# Altium schematic sheet RS485.SchDoc
size A3
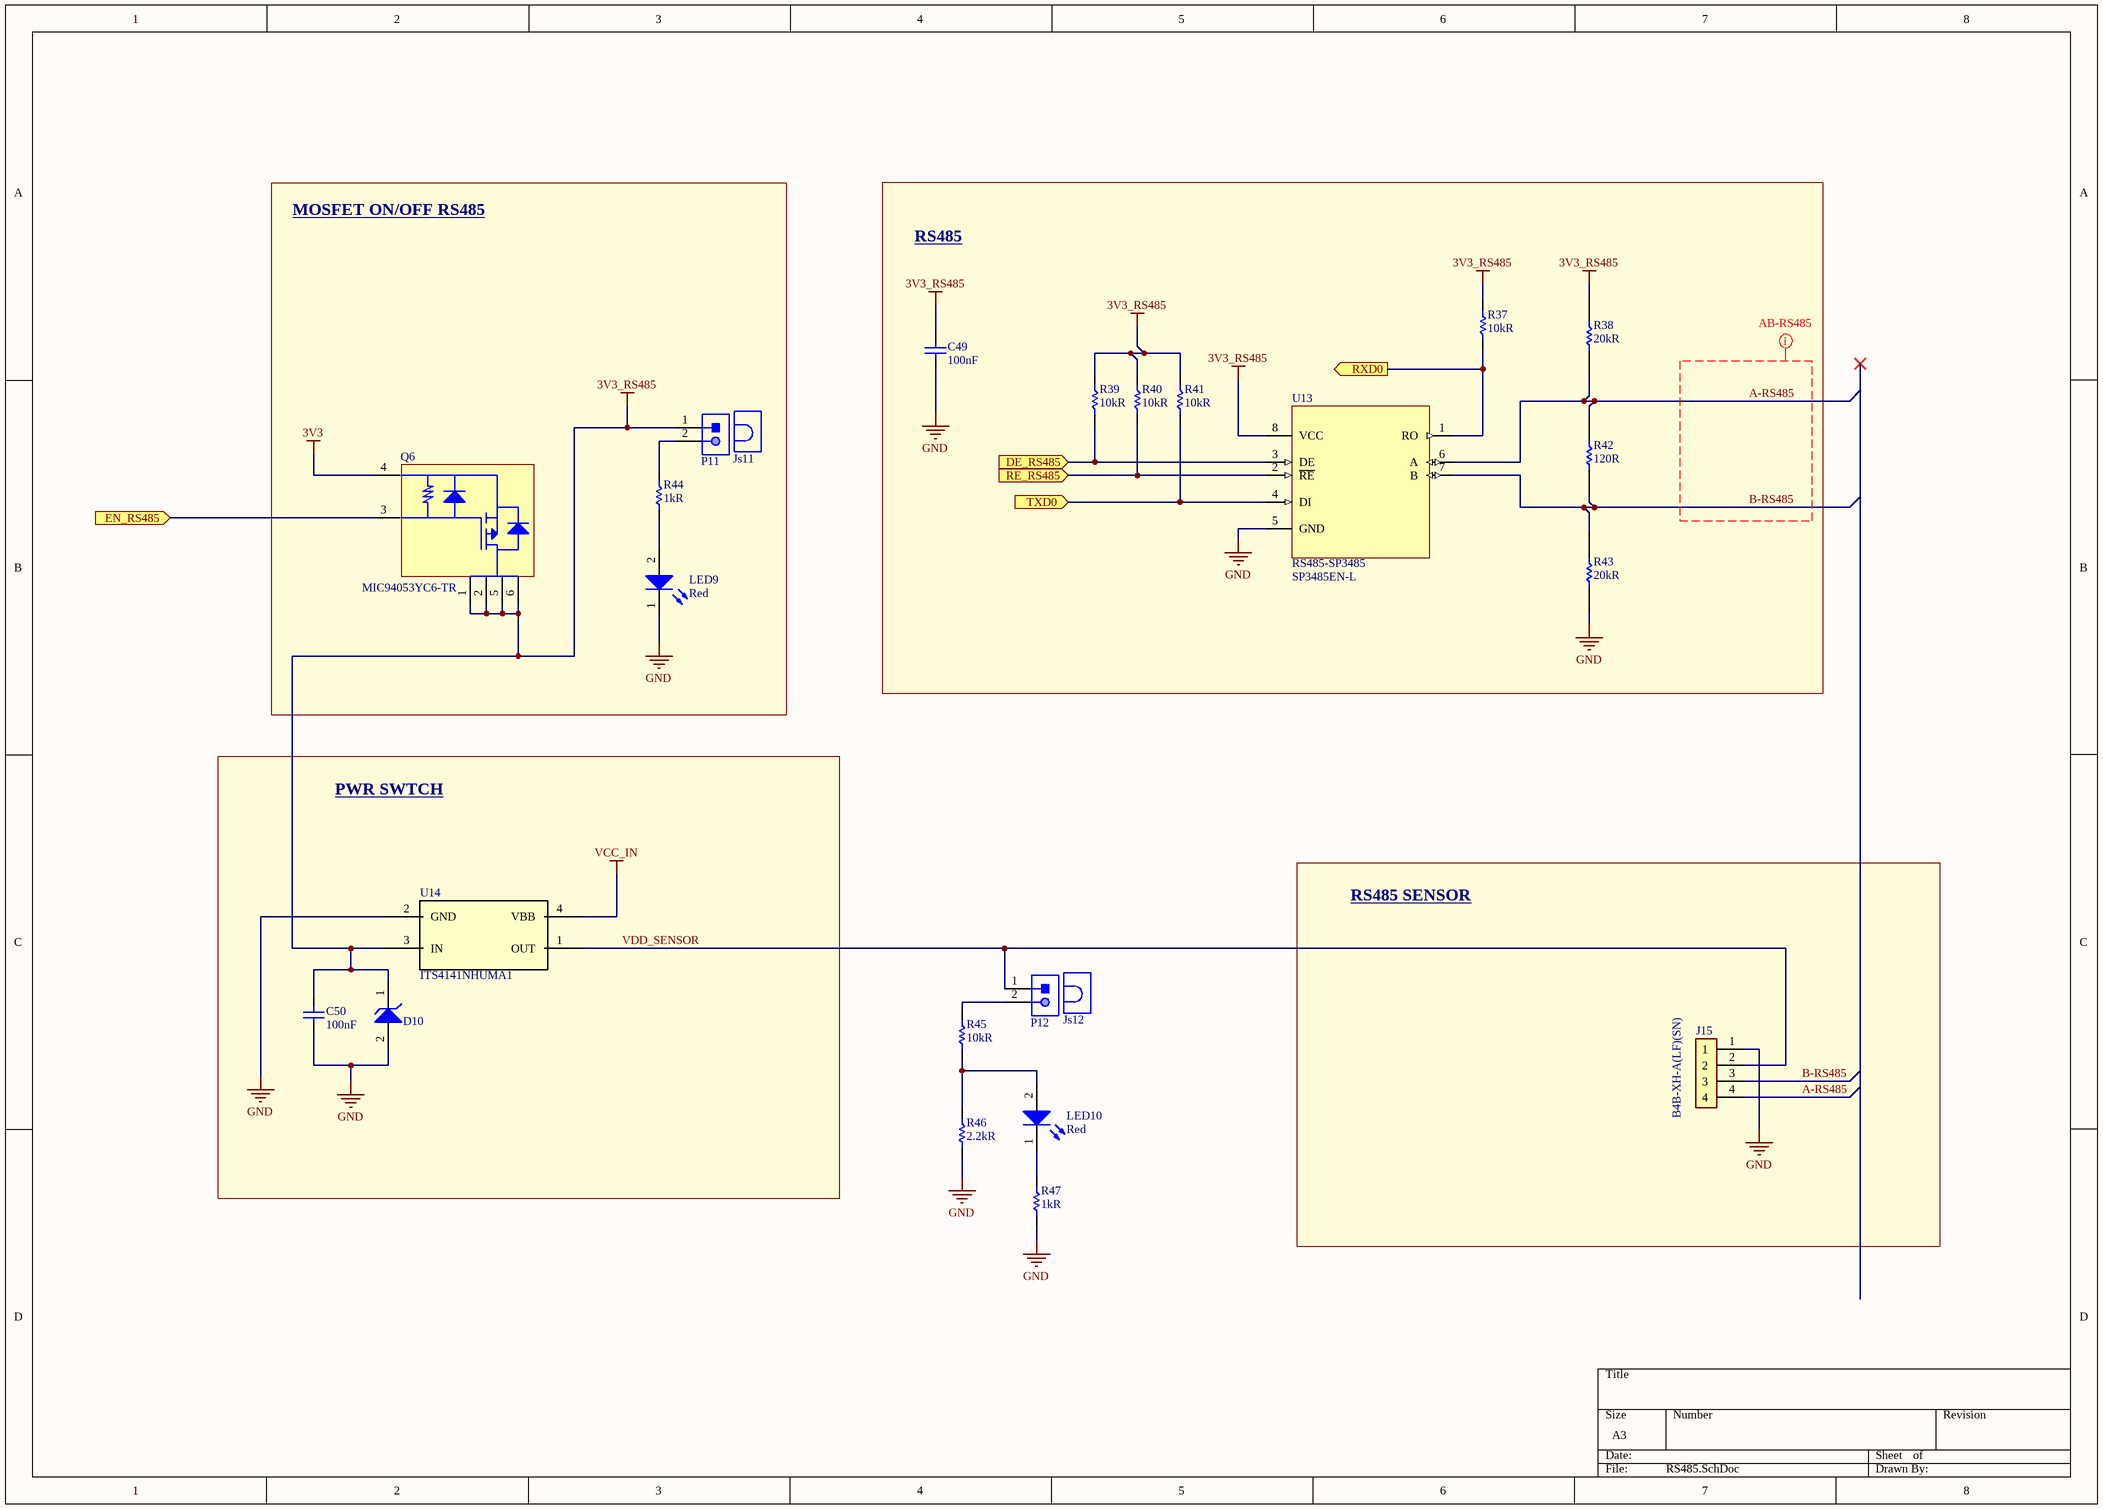
[diagram p0: RS485.SchDoc]

## Parts
C49  100nF  [Cap 0805 (2012 Metric)]
C50  100nF  [Cap 0805 (2012 Metric)]
D10  Diode  [Diode SOD123]  (value not drawn)
J15  B4B-XH-A(LF)(SN)  [B4B-XH-A(LF)(SN)]
Js11  Jumper (2x1)  [Header JMP 2x1]  (value not drawn)
Js12  Jumper (2x1)  [Header JMP 2x1]  (value not drawn)
LED9  Red  [LED 0805(2012 METRIC)]
LED10  Red  [LED 0805(2012 METRIC)]
P11  Header 2x1  [Header 2x1]  (value not drawn)
P12  Header 2x1  [Header 2x1]  (value not drawn)
Q6  MIC94053YC6-TR  [SC-70-6]
R37  10kR  [Res 0603 (1608 Metric)]
R38  20kR  [Res 0805 (2012 Metric)]
R39  10kR  [Res 0603 (1608 Metric)]
R40  10kR  [Res 0603 (1608 Metric)]
R41  10kR  [Res 0603 (1608 Metric)]
R42  120R  [Res 0805 (2012 Metric)]
R43  20kR  [Res 0805 (2012 Metric)]
R44  1kR  [Res 0805 (2012 Metric)]
R45  10kR  [Res 0603 (1608 Metric)]
R46  2.2kR  [Res 0805 (2012 Metric)]
R47  1kR  [Res 0805 (2012 Metric)]
U13  RS485-SP3485  Manufacturer Part Number: SP3485EN-L  [SP3485]
U14  ITS4141NHUMA1  [ITS4141NHUMA1]

## Blocks framed on the sheet
MOSFET ON/OFF RS485: Js11 LED9 P11 Q6 R44
RS485: C49 R37-R43 U13
PWR SWTCH: C50 D10 U14
RS485 SENSOR: J15

## Ports
DE_RS485 (in), EN_RS485 (in), RE_RS485 (in), RXD0 (out), TXD0 (in)

## Nets
3V3: Q6.4(S)
3V3_RS485: C49.1 C50.1 D10.1(K) P11.1 Q6.1(D) Q6.2(D) Q6.5(D) Q6.6(D) R37.1 R38.1 R39.1 R40.1 R41.1 U13.8(VCC) U14.3(IN)
GND: C49.2 C50.2 D10.2(A) J15.1 LED9.1(K) R43.2 R46.2 R47.2 U13.5(GND) U14.2(GND)
VCC_IN: U14.4(VBB)
A-RS485: J15.4 R38.2 R42.1 U13.6(A)
B-RS485: J15.3 R42.2 R43.1 U13.7(B)
DE_RS485: R39.2 U13.3(DE) ; port DE_RS485
EN_RS485: Q6.3(G) ; port EN_RS485
RE_RS485: R40.2 U13.2(~{RE}) ; port RE_RS485
RXD0: R37.2 U13.1(RO) ; port RXD0
TXD0: R41.2 U13.4(DI) ; port TXD0
VDD_SENSOR: J15.2 P12.1 U14.1(OUT)
NetLED9_2: LED9.2(A) R44.2
NetLED10_1: LED10.1(K) R47.1
NetLED10_2: LED10.2(A) R45.2 R46.1
NetP11_2: P11.2 R44.1
NetP12_2: P12.2 R45.1

## Layout directives
net class AB-RS485: A-RS485, B-RS485

## Library data of the parts
C49 C50 = Capacitor: YAGEO (PHYCOMP)         CC0805ZRY5V9BB104             SMD Multilayer Ceramic Capacitor, 0805 [2012 Metric], 0.1 uF, 50 V, +80%, -20%, Y5V, CC Series; Tolerance: 80%; Voltage Rating: 50V; Link: https://www.digikey.com/es/products/detail/yageo/CC0805ZRY5V9BB104/2103099?s=N4IgTCBcDaIMJwAwA5EFYBaAlAmmgagJwBCxAjIgCwgC6AvkA; Supplier 1: Digi-Key; Supplier Part Number 1: 311-1361-1-ND; Manufacturer: Yageo; Manufacturer Part Number: CC0805ZRY5V9BB104; RoHS: Yes; Category: Ceramic Capacitors; Stock 1: 92689; Pricing 1: 1=0,10000, 10=0,07000, 50=0,03800, 100=0,03100, 500=0,02214, 1000=0,01739 (USD); Mount: Surface Mount; Case/Package: 0805; Number of Pins: 2; Case Code (Metric): 2012; Case Code (Imperial): 0805; Material: Ceramic; Dielectric Material: Ceramic; Min Operating Temperature: -30°C; Max Operating Temperature: 85°C; Capacitance: 100nF; Dielectric: Y5V; Package Quantity: 1; Packaging: Tape and Reel; Voltage Rating (DC): 50V; Termination: SMD/SMT; Resistor Type: Ceramic; Series: CC; Construction: Flat; Length: 2mm; Width: 0.049inch; Height: 0.6mm; Depth: 1.25mm; Thickness: 0.024inch; Radiation Hardening: No; REACH SVHC: No SVHC; Lead Free: Lead Free; Halogen Free: Halogen Free; RoHS Compliant: Yes; ComponentLink1URL: https://datasheet.ciiva.com/144/mlccorderingcode-144209.pdf?src-supplier=Digi-Key; ComponentLink1Description: https://datasheet.ciiva.com/144/mlccorderingcode-144209.pdf?src-supplier=Digi-Key; ComponentLink2URL: https://datasheet.ciiva.com/144/mlccorderingcode-144210.pdf?src-supplier=Digi-Key; ComponentLink2Description: https://datasheet.ciiva.com/144/mlccorderingcode-144210.pdf?src-supplier=Digi-Key; ComponentLink3URL: https://datasheet.ciiva.com/144/mlccorderingcode-144211.pdf?src-supplier=Digi-Key; ComponentLink3Description: https://datasheet.ciiva.com/144/mlccorderingcode-144211.pdf?src-supplier=Digi-Key; ComponentLink4URL: https://datasheet.ciiva.com/11465/upy-gphc-y5v-6-3v-to-50v-5-11465865.pdf?src-supplier=Avnet; ComponentLink4Description: https://datasheet.ciiva.com/11465/upy-gphc-y5v-6-3v-to-50v-5-11465865.pdf?src-supplier=Avnet; ComponentLink5URL: https://datasheet.ciiva.com/13389/upy-gp-np0-16v-to-50v-8-13389351.pdf?src-supplier=Mouser; ComponentLink5Description: https://datasheet.ciiva.com/13389/upy-gp-np0-16v-to-50v-8-13389351.pdf?src-supplier=Mouser; ComponentLink6URL: https://datasheet.ciiva.com/17435/upy-gphc-y5v-6-3v-to-50v-5-17435053.pdf?src-supplier=Avnet+Europe; ComponentLink6Description: https://datasheet.ciiva.com/17435/upy-gphc-y5v-6-3v-to-50v-5-17435053.pdf?src-supplier=Avnet+Europe; ComponentLink7URL: https://datasheet.ciiva.com/15189/getdatasheetpartid-55882-15189238.pdf?src-supplier=Verical; ComponentLink7Description: https://datasheet.ciiva.com/15189/getdatasheetpartid-55882-15189238.pdf?src-supplier=Verical; ComponentLink8URL: https://datasheet.ciiva.com/16747/upy-gphc-y5v-6-3v-to-50v-5-revised-16747323.pdf?src-supplier=Future+Electronics; ComponentLink8Description: https://datasheet.ciiva.com/16747/upy-gphc-y5v-6-3v-to-50v-5-revised-16747323.pdf?src-supplier=Future+Electronics; ComponentLink9URL: https://datasheet.ciiva.com/28450/1132289-28450870.pdf?src-supplier=Element14; ComponentLink9Description: https://datasheet.ciiva.com/28450/1132289-28450870.pdf?src-supplier=Element14; ComponentLink10URL: https://datasheet.ciiva.com/29241/445331-da-01-en-kerko-chip-0805-y5v0-1uf-20-80proz50vg-29241946.pdf?src-supplier=Conrad; ComponentLink10Description: https://datasheet.ciiva.com/29241/445331-da-01-en-kerko-chip-0805-y5v0-1uf-20-80proz50vg-29241946.pdf?src-supplier=Conrad
D10 = Diode: DIODE GEN PURP 75V 150MA 0603; Manufacturer: Taiwan Semiconductor; Manufacturer Part Number: TS4148CRZG; Forward Voltage: 1.25V; Peak Non-Repetitive Surge Current: 800mA; Element Configuration: Single; Max Forward Surge Current (Ifsm): 2A; Reverse Recovery Time: 4ns; Link: https://www.digikey.com/es/products/detail/taiwan-semiconductor-corporation/TS4148C-RZG/7359811?s=N4IgTCBcDaICoGUAsBGJAOAwgJQFoHEQBdAXyA; Supplier 1: Digi-Key; Supplier Part Number 1: TS4148CRZGCT-ND; RoHS: Yes; Category: Uncategorized; Stock 1: 278970; Pricing 1: 1=0,39000, 10=0,29400, 100=0,16640, 500=0,11022, 1000=0,08450, 2000=0,07348 (USD); Mount: Surface Mount; Case/Package: SMD/SMT; Number of Pins: 2; Min Operating Temperature: -55°C; Max Operating Temperature: 150°C; Packaging: Tape and Reel; Package Quantity: 5000; Max Repetitive Reverse Voltage (Vrrm): 75V; Radiation Hardening: No; RoHS Compliant: Yes; ComponentLink1URL: https://datasheet.ciiva.com/18168/getdatasheetpartid-464901-18168310.pdf?src-supplier=Verical; ComponentLink1Description: https://datasheet.ciiva.com/18168/getdatasheetpartid-464901-18168310.pdf?src-supplier=Verical
J15 = B4B-XH-A(LF)(SN): JST (JAPAN SOLDERLESS TERMINALS) - B4B-XH-A (LF)(SN) - Wire-To-Board Connector, Vertical, 2.5 mm, 4 Contacts, Header, XH Series, Through Hole, 1 Rows; Insulation Resistance: 1GR; Current Rating: 3A; Contact Resistance: 20mR; Gender: Male; Number of Positions: 4; Max Voltage Rating (AC): 250V; Connector Type: Male Pin; Pitch: 2.5mm; Wire/Cable Gauge: 22AWG; Supplier 1: Arrow Electronics; Manufacturer: JST; RoHS: Yes; Category: FFC / FPC; Mount: Through Hole; Contact Plating: Tin,Copper,Lead; Contact Material: Brass; Color: Natural; Housing Material: Polyamide; Housing Color: White; Material: Polyamide; Min Operating Temperature: -25°C; Max Operating Temperature: 85°C; Termination: Press-Fit; Series: XH; Number of Rows: 1; Packaging: Bulk; Orientation: Straight; Max Current Rating: 3A; Package Quantity: 500; Number of Contacts: 4; Contact Type: Male Pin; Voltage Rating (AC): 250V; Voltage Rating: 250V; Max Voltage Rating (DC): 250V; Length: 12.4mm; Depth: 5.75mm; Lead Pitch: 2.5mm; REACH SVHC: No SVHC; Lead Free: Lead Free; ComponentLink1URL: https://datasheet.ciiva.com/26894/getdatasheetpartid-455616-26894787.pdf?src-supplier=Verical; ComponentLink1Description: https://datasheet.ciiva.com/26894/getdatasheetpartid-455616-26894787.pdf?src-supplier=Verical; ComponentLink2URL: https://datasheet.ciiva.com/16203/b4b-xh-alfsn-16203642.pdf?src-supplier=Future+Electronics; ComponentLink2Description: https://datasheet.ciiva.com/16203/b4b-xh-alfsn-16203642.pdf?src-supplier=Future+Electronics; ComponentLink3URL: https://datasheet.ciiva.com/26924/getdatasheetpartid-640571-26924035.pdf?src-supplier=Verical; ComponentLink3Description: https://datasheet.ciiva.com/26924/getdatasheetpartid-640571-26924035.pdf?src-supplier=Verical; ComponentLink4URL: https://datasheet.ciiva.com/726/exh-726404.pdf?src-supplier=Digi-Key; ComponentLink4Description: https://datasheet.ciiva.com/726/exh-726404.pdf?src-supplier=Digi-Key; Manufacturer Part Number: B4B-XH-A(LF)(SN); Supplier Part Number 1: B4B-XH-A (LF)(SN); Link: https://www.digikey.com/es/products/detail/jst-sales-america-inc/B4B-XH-A-LF-SN/1651047?s=N4IgTCBcDaIEIBY4FoAaAJZBBAFAGQDEBKHAZQDkiQBdAXyA
Js11 Js12 = Jumper (2x1): 2 (1 x 2) Position Shunt Connector Black Open Top 0.100" (2.54mm) Gold; Manufacturer: Sullins; Manufacturer Part Number: QPC02SXGN-RC; Number of Positions: 2; Pitch: 0.1inch; Link: https://www.digikey.com/product-detail/en/sullins-connector-solutions/QPC02SXGN-RC/S9337-ND/2618262; Supplier 1: Digi-Key; Supplier Part Number 1: S9337-ND; RoHS: Yes; Category: Connectors; Stock 1: 529611; Pricing 1: 1=0,10000, 10=0,05900, 25=0,04400, 50=0,03780, 100=0,03650, 250=0,03152, 500=0,03024, 1000=0,02646, 2500=0,02394 (USD); Case/Package: 100; Contact Plating: Gold; Package Quantity: 2000; Packaging: Bulk; Height: 0.235inch; Lead Free: Lead Free; ComponentLink1URL: https://datasheet.ciiva.com/767/284-sxgn-11510-767869.pdf?src-supplier=Digi-Key; ComponentLink1Description: https://datasheet.ciiva.com/767/284-sxgn-11510-767869.pdf?src-supplier=Digi-Key
LED9 LED10 = LED: SMD LED red 2.4 V 0805, 150080RS75000, Würth Elektronik; Manufacturer: Wurth Electronics; Luminous Intensity: 150mcd; Viewing Angle: 140°; Forward Voltage: 2V; Wavelength: 625nm; Lens Style: Clear,Rectangular; Forward Current: 30mA; Test Current: 20mA; Link: https://www.digikey.com/es/products/detail/w%C3%BCrth-elektronik/150080RS75000/4489918?s=N4IgTCBcDaIIwFYAMSAcSBKBlA7MlIAugL5A; Supplier 1: Digi-Key; Supplier Part Number 1: 732-4984-1-ND; Manufacturer Part Number: 150080RS75000; RoHS: Yes; Category: LEDs; Stock 1: 57843; Pricing 1: 1=0,18000, 50=0,16500, 100=0,14200, 500=0,12300 (USD); Mount: Surface Mount; Case/Package: 0805; Color: Red; Case Code (Metric): 2012; Case Code (Imperial): 0805; Min Operating Temperature: -40°C; Max Operating Temperature: 85°C; Package Quantity: 4000; Packaging: Tape and Reel; Dominant Wavelength: 625nm; Length: 2mm; Width: 1.25mm; Height: 0.7mm; REACH SVHC: Unknown; RoHS Compliant: Yes; ComponentLink1URL: https://datasheet.ciiva.com/22656/150080rs75000-22656961.pdf?src-supplier=Element14; ComponentLink1Description: https://datasheet.ciiva.com/22656/150080rs75000-22656961.pdf?src-supplier=Element14; ComponentLink2URL: https://datasheet.ciiva.com/29279/759435-da-01-en-chipled-0805-w-kl-rot-150080rs75000-29279032.pdf?src-supplier=Conrad; ComponentLink2Description: https://datasheet.ciiva.com/29279/759435-da-01-en-chipled-0805-w-kl-rot-150080rs75000-29279032.pdf?src-supplier=Conrad
P11 P12 = Header 2x1: Connector Header Through Hole 2 position 0.100" (2.54mm); Manufacturer: Amphenol FCI; Manufacturer Part Number: 68001-402HLF; Number of Contacts: 2; Connector Type: Male Pin; Insulation Resistance: 5GR; Max Voltage Rating (AC): 1.5kV; Gender: Male; Current Rating: 3A; Contact Post Length: 3.05mm; Link: https://www.digikey.com/product-detail/en/amphenol-icc-fci/68001-402HLF/609-3507-ND/1530472; Supplier 1: Digi-Key; Supplier Part Number 1: 609-3507-ND; RoHS: Yes; Category: Headers and Wire Housings; Stock 1: 5598; Pricing 1: 1=0,12000, 10=0,11600, 100=0,07160, 500=0,05928, 1000=0,05187, 5000=0,04446, 10000=0,04323 (USD); Mount: Through Hole; Contact Plating: Tin; Housing Material: Thermoplastic; Housing Color: Black; Color: Black; Contact Material: Bronze; Min Operating Temperature: -65°C; Max Operating Temperature: 125°C; Termination: Solder; Number of Rows: 1; Number of Positions: 2; Orientation: Straight; Package Quantity: 100; Packaging: Bulk; Contact Gender: Male; Voltage Rating: 1.5kV; Length: 5.08mm; Pitch: 2.54mm; Contact Mating Length: 0.23inch; Depth: 2.41mm; Radiation Hardening: No; REACH SVHC: No SVHC; Flammability Rating: UL94 V-0; Lead Free: Lead Free; ComponentLink1URL: https://datasheet.ciiva.com/724/68000-724389.pdf?src-supplier=Digi-Key; ComponentLink1Description: https://datasheet.ciiva.com/724/68000-724389.pdf?src-supplier=Digi-Key; ComponentLink2URL: https://datasheet.ciiva.com/16726/68000-16726185.pdf?src-supplier=Avnet+Europe; ComponentLink2Description: https://datasheet.ciiva.com/16726/68000-16726185.pdf?src-supplier=Avnet+Europe; ComponentLink3URL: https://datasheet.ciiva.com/10149/68000-10149338.pdf?src-supplier=Avnet; ComponentLink3Description: https://datasheet.ciiva.com/10149/68000-10149338.pdf?src-supplier=Avnet; ComponentLink4URL: https://datasheet.ciiva.com/46385/1748756-46385306.pdf?src-supplier=Element14; ComponentLink4Description: https://datasheet.ciiva.com/46385/1748756-46385306.pdf?src-supplier=Element14
Q6 = TransistorMosfet(Load): P-Channel 6V 2A (Ta) 270mW (Ta) Surface Mount SC-70-6; Manufacturer: Microchip; Link: https://www.digikey.com/product-detail/en/microchip-technology/MIC94053YC6-TR/576-2939-1-ND/1822099; Supplier 1: Digi-Key; Supplier Part Number 1: 576-2939-1-ND; Manufacturer Part Number: MIC94053YC6-TR; RoHS: Yes; Category: MOSFETs; Stock 1: 3005; Pricing 1: 1=0,58000, 25=0,48000, 100=0,46250 (USD); ComponentLink1URL: https://datasheet.ciiva.com/6379/mic94052-53-6379193.pdf?src-supplier=Digi-Key; ComponentLink1Description: https://datasheet.ciiva.com/6379/mic94052-53-6379193.pdf?src-supplier=Digi-Key; ComponentLink2URL: https://datasheet.ciiva.com/6379/mic94052-53-6379189.pdf?src-supplier=Digi-Key; ComponentLink2Description: https://datasheet.ciiva.com/6379/mic94052-53-6379189.pdf?src-supplier=Digi-Key; ComponentLink3URL: https://datasheet.ciiva.com/46408/264781-46408581.pdf?src-supplier=Element14; ComponentLink3Description: https://datasheet.ciiva.com/46408/264781-46408581.pdf?src-supplier=Element14; ComponentLink4URL: https://datasheet.ciiva.com/15200/getdatasheetpartid-111629-15200795.pdf?src-supplier=Verical; ComponentLink4Description: https://datasheet.ciiva.com/15200/getdatasheetpartid-111629-15200795.pdf?src-supplier=Verical
R37 R39-R41 R45 = Resistor: PANASONIC - ERJ-3EKF1002V. - THICK FILM CHIP RES, 0603, 1%, PRECISION; Temperature Coefficient: 100ppm/°C; Power Rating: 100mW; Voltage Rating: 75V; Link: https://www.digikey.com/es/products/detail/panasonic-electronic-components/ERJ-3EKF1002V/196066?s=N4IgTCBcDaIKICUBSBaAzHA0gMQIwAZ8wA1EAXQF8g; Supplier 1: Digi-Key; Supplier Part Number 1: P10.0KHCT-ND; Manufacturer: Panasonic; Manufacturer Part Number: ERJ-3EKF1002V; RoHS: Yes; Category: Chip SMD Resistors; Stock 1: 4473924; Pricing 1: 1=0,10000, 10=0,03700, 100=0,01490, 1000=0,00670, 2500=0,00582 (USD); Mount: Surface Mount; Case/Package: 0603; Number of Pins: 2; Case Code (Metric): 1608; Case Code (Imperial): 0603; Contact Plating: Tin; Size Code: 0603; Min Operating Temperature: -55°C; Max Operating Temperature: 155°C; Resistance: 10kR; Packaging: Tape and Reel; Tolerance: 1%; Series: ERJ; Resistor Type: Thick Film; Number of Terminations: 2; Package Quantity: 1; Termination: SMD/SMT; Max Power Dissipation: 100mW; Voltage Rating (DC): 75V; Resistance Tolerance: 1%; Construction: Rectangular; Features: Automotive AEC-Q200; Technology: THICK FILM; Length: 1.6mm; Width: 0.031inch; Height: 0.45mm; Depth: 0.8mm; Radiation Hardening: No; Military Standard: Not; Lead Free: Lead Free; RoHS Compliant: Yes; REACH SVHC: No SVHC; ComponentLink1URL: https://datasheet.ciiva.com/48530/aoa0000ce2-48530988.pdf?src-supplier=Avnet; ComponentLink1Description: https://datasheet.ciiva.com/48530/aoa0000ce2-48530988.pdf?src-supplier=Avnet; ComponentLink2URL: https://datasheet.ciiva.com/24070/aoa0000ce2-24070318.pdf?src-supplier=Mouser; ComponentLink2Description: https://datasheet.ciiva.com/24070/aoa0000ce2-24070318.pdf?src-supplier=Mouser; ComponentLink3URL: https://datasheet.ciiva.com/9194/aoa0000ce2-9194199.pdf?src-supplier=Avnet; ComponentLink3Description: https://datasheet.ciiva.com/9194/aoa0000ce2-9194199.pdf?src-supplier=Avnet; ComponentLink4URL: https://datasheet.ciiva.com/30208/aoa0000ce2-30208985.pdf?src-supplier=Onlinecomponents.com; ComponentLink4Description: https://datasheet.ciiva.com/30208/aoa0000ce2-30208985.pdf?src-supplier=Onlinecomponents.com; ComponentLink5URL: https://datasheet.ciiva.com/16759/70260748-16759807.pdf?src-supplier=Allied+Electronics; ComponentLink5Description: https://datasheet.ciiva.com/16759/70260748-16759807.pdf?src-supplier=Allied+Electronics; ComponentLink6URL: https://datasheet.ciiva.com/7830/aoa0000ce2-7830729.pdf?src-supplier=Element14; ComponentLink6Description: https://datasheet.ciiva.com/7830/aoa0000ce2-7830729.pdf?src-supplier=Element14; ComponentLink7URL: https://datasheet.ciiva.com/28514/426256-28514198.pdf?src-supplier=Element14; ComponentLink7Description: https://datasheet.ciiva.com/28514/426256-28514198.pdf?src-supplier=Element14; ComponentLink8URL: https://datasheet.ciiva.com/46372/1678782-46372725.pdf?src-supplier=Element14; ComponentLink8Description: https://datasheet.ciiva.com/46372/1678782-46372725.pdf?src-supplier=Element14; ComponentLink9URL: https://datasheet.ciiva.com/16511/aoa0000ce2-16511861.pdf?src-supplier=Avnet+Asia; ComponentLink9Description: https://datasheet.ciiva.com/16511/aoa0000ce2-16511861.pdf?src-supplier=Avnet+Asia; ComponentLink10URL: https://datasheet.ciiva.com/17212/aoa0000ce2-17212105.pdf?src-supplier=Avnet+Europe; ComponentLink10Description: https://datasheet.ciiva.com/17212/aoa0000ce2-17212105.pdf?src-supplier=Avnet+Europe
R38 R43 = Resistor: 20 kOhms ±1% 0.125W, 1/8W Chip Resistor 0805 (2012 Metric) Moisture Resistant Thick Film; Manufacturer: Yageo; Manufacturer Part Number: RC0805FR-0720KL; Temperature Coefficient: 100ppm/°C; Voltage Rating (DC): 150V; Power Rating: 125mW; Link: https://www.digikey.com/product-detail/en/yageo/RC0805FR-0720KL/311-20-0KCRCT-ND/730667; Supplier 1: Digi-Key; Supplier Part Number 1: 311-20.0KCRCT-ND; RoHS: Yes; Category: Chip SMD Resistors; Stock 1: 4531669; Pricing 1: 1=0,10000, 10=0,04000, 100=0,01630, 1000=0,00731, 2500=0,00635 (USD); Case/Package: 0805; Number of Pins: 2; Case Code (Imperial): 0805; Case Code (Metric): 2012; Min Operating Temperature: -55°C; Max Operating Temperature: 155°C; Tolerance: 1%; Resistance: 20kR; Composition: Thick Film; Packaging: Tape and Reel; Termination: SMD/SMT; Military Standard: Not; Voltage Rating: 150V; Length: 2mm; Height: 0.5mm; Depth: 1.25mm; Lead Free: Lead Free; REACH SVHC: Unknown; ComponentLink1URL: https://datasheet.ciiva.com/15189/getdatasheetpartid-330251-15189927.pdf?src-supplier=Verical; ComponentLink1Description: https://datasheet.ciiva.com/15189/getdatasheetpartid-330251-15189927.pdf?src-supplier=Verical; ComponentLink2URL: https://datasheet.ciiva.com/46395/444164-46395127.pdf?src-supplier=Element14; ComponentLink2Description: https://datasheet.ciiva.com/46395/444164-46395127.pdf?src-supplier=Element14; ComponentLink3URL: https://datasheet.ciiva.com/12666/rc0805-12666938.pdf?src-supplier=Mouser; ComponentLink3Description: https://datasheet.ciiva.com/12666/rc0805-12666938.pdf?src-supplier=Mouser
R42 = Resistor: Res Thick Film 0805 120 Ohm 1% 0.125W(1/8W) ±100ppm/C Pad SMD Automotive T/R; Manufacturer: TE Connectivity; Manufacturer Part Number: CRGCQ0805F120R; Max Power Dissipation: 125mW; Temperature Coefficient: 100ppm/°C; Link: https://www.digikey.com/product-detail/en/te-connectivity-passive-product/CRGCQ0805F120R/A129738CT-ND/8577570; Supplier 1: Digi-Key; Supplier Part Number 1: A129738CT-ND; RoHS: No; Stock 1: 30434; Pricing 1: 1=0,10000, 10=0,04800, 100=0,01960, 1000=0,00882, 2500=0,00766 (USD); Case/Package: 0805; Case Code (Imperial): 0805; Case Code (Metric): 2012; Min Operating Temperature: -55°C; Max Operating Temperature: 155°C; Number of Terminations: 2; Composition: Thick Film; Features: Moisture Resistant,Automotive AEC-Q200; Packaging: Tape and Reel; Resistance: 120R; Tolerance: 1%; ComponentLink1URL: https://4donline.ihs.com/images/VipMasterIC/IC/TYEL/TYEL-S-A0004929575/TYEL-S-A0004929575-1.pdf?hkey=52A5661711E402568146F3353EA87419&src-supplier=Farnell; ComponentLink1Description: https://4donline.ihs.com/images/VipMasterIC/IC/TYEL/TYEL-S-A0004929575/TYEL-S-A0004929575-1.pdf?hkey=52A5661711E402568146F3353EA87419&src-supplier=Farnell; ComponentLink2URL: https://www.te.com/commerce/DocumentDelivery/DDEController?Action=srchrtrv&amp;DocNm=1773204-3&amp;DocType=DS&amp;DocLang=English&src-supplier=Digi-Key; ComponentLink2Description: https://www.te.com/commerce/DocumentDelivery/DDEController?Action=srchrtrv&amp;DocNm=1773204-3&amp;DocType=DS&amp;DocLang=English&src-supplier=Digi-Key; ComponentLink3URL: https://4donline.ihs.com/images/VipMasterIC/IC/TYEL/TYEL-S-A0004929575/TYEL-S-A0004929575-1.pdf?hkey=52A5661711E402568146F3353EA87419&src-supplier=Element14; ComponentLink3Description: https://4donline.ihs.com/images/VipMasterIC/IC/TYEL/TYEL-S-A0004929575/TYEL-S-A0004929575-1.pdf?hkey=52A5661711E402568146F3353EA87419&src-supplier=Element14; ComponentLink4URL: https://4donline.ihs.com/images/VipMasterIC/IC/TYEL/TYEL-S-A0004929575/TYEL-S-A0004929575-1.pdf?hkey=52A5661711E402568146F3353EA87419&src-supplier=Newark; ComponentLink4Description: https://4donline.ihs.com/images/VipMasterIC/IC/TYEL/TYEL-S-A0004929575/TYEL-S-A0004929575-1.pdf?hkey=52A5661711E402568146F3353EA87419&src-supplier=Newark
R44 R47 = Resistor: RES 1K OHM 1% 1/4W 0805; Manufacturer: Stackpole Electronics; Manufacturer Part Number: RNCP0805FTD1K00; Power Rating: 250mW; Temperature Coefficient: 100ppm/°C; Link: https://www.digikey.com/es/products/detail/stackpole-electronics-inc/RNCP0805FTD1K00/2240229?s=N4IgTCBcDaIEoDkDCAFADADjQVgGIBUARARgGk00QBdAXyA; Supplier 1: Digi-Key; Supplier Part Number 1: RNCP0805FTD1K00CT-ND; RoHS: Yes; Category: Chip SMD Resistors; Stock 1: 316834; Pricing 1: 1=0,10000, 10=0,07000, 100=0,02830, 1000=0,01272, 2500=0,01104 (USD); Mount: Surface Mount; Case/Package: 0805; Case Code (Metric): 2012; Case Code (Imperial): 0805; Size Code: 0805; Min Operating Temperature: -55°C; Max Operating Temperature: 155°C; Tolerance: 1%; Resistance: 1kR; Packaging: Tape and Reel; Resistor Type: Thin Film; Number of Terminations: 2; Max Power Dissipation: 250mW; Features: Moisture Resistant,Anti-Sulfur; Series: RNCP; Length: 0.079inch; Width: 0.049inch; Height: 0.024inch; Lead Free: Lead Free; RoHS Compliant: Yes; ComponentLink1URL: https://www.seielect.com/catalog/SEI-Packaging.pdf?src-supplier=Digi-Key; ComponentLink1Description: https://www.seielect.com/catalog/SEI-Packaging.pdf?src-supplier=Digi-Key; ComponentLink2URL: https://www.seielect.com/Catalog/SEI-rncp.pdf?src-supplier=Digi-Key; ComponentLink2Description: https://www.seielect.com/Catalog/SEI-rncp.pdf?src-supplier=Digi-Key; ComponentLink3URL: http://www.seielect.com/Catalog/SEI-rncp.pdf?src-supplier=Future+Electronics; ComponentLink3Description: http://www.seielect.com/Catalog/SEI-rncp.pdf?src-supplier=Future+Electronics
R46 = Resistor: Res Thick Film 0805 2.2K Ohm 5% 1/8W ±200ppm/°C Molded SMD SMD Paper T/R; Manufacturer: Vishay Dale; Manufacturer Part Number: CRCW08052K20JNEA; Power Rating: 125mW; Voltage Rating: 150V; Link: https://www.digikey.com/es/products/detail/CRCW08052K20JNEAC/541-4169-1-ND/7928852?utm_campaign=buynow&utm_medium=aggregator&curr=usd&utm_source=octopart; Supplier 1: Digi-Key; Supplier Part Number 1: 541-2.2KACT-ND; RoHS: Yes; Category: Chip SMD Resistors; Stock 1: 1572; Pricing 1: 1=0,10000, 10=0,04200, 100=0,01700, 1000=0,00762, 2500=0,00661 (USD); Case/Package: 0805; Weight: 0.000194oz; Case Code (Imperial): 0805; Case Code (Metric): 2012; Contact Plating: Tin; Min Operating Temperature: -55°C; Max Operating Temperature: 155°C; Resistance: 2.2kR; Tolerance: 5%; Packaging: Tape and Reel; Package Quantity: 5000; Termination: SMD/SMT; Resistor Type: Thick Film; Temperature Coefficient: 200ppm/°C; Voltage Rating (DC): 150V; Working Voltage: 150V; Number of Terminations: 2; Features: Automotive AEC-Q200; Series: CRCW; Max Power Dissipation: 125mW; Construction: Rectangular; Technology: THICK FILM; Resistance Tolerance: 5%; Length: 2mm; Width: 1.25mm; Height: 0.45mm; Depth: 1.25mm; Radiation Hardening: No; Lead Free: Lead Free; RoHS Compliant: Yes; REACH SVHC: Unknown; Military Standard: Not; ComponentLink1URL: https://datasheet.ciiva.com/5552/dcrcwe3-109170-5552443.pdf?src-supplier=Mouser; ComponentLink1Description: https://datasheet.ciiva.com/5552/dcrcwe3-109170-5552443.pdf?src-supplier=Mouser; ComponentLink2URL: https://datasheet.ciiva.com/16199/dcrcwe3-16199755.pdf?src-supplier=Future+Electronics; ComponentLink2Description: https://datasheet.ciiva.com/16199/dcrcwe3-16199755.pdf?src-supplier=Future+Electronics; ComponentLink3URL: https://datasheet.ciiva.com/16723/70201119-16723963.pdf?src-supplier=Allied+Electronics; ComponentLink3Description: https://datasheet.ciiva.com/16723/70201119-16723963.pdf?src-supplier=Allied+Electronics
U13 = RS485-SP3485: Single Transmitter/Receiver RS-422/RS-485 8-Pin SOIC N; Manufacturer: Exar; Data Rate: 10Mbps; Simplex/Duplex: Half Duplex; Number of Receivers: 1; Operating Supply Voltage: 3.3V; Min Supply Voltage: 3.135V; Max Supply Voltage: 3.465V; Nominal Supply Current: 2mA; Logic Function: Transceiver; Max Power Dissipation: 600mW; Output Current: 1uA; Supplier 1: Allied Electronics; RoHS: Yes; Category: Interface ICs; Mount: Surface Mount; Case/Package: SOIC N; Number of Pins: 8; Min Operating Temperature: -40°C; Max Operating Temperature: 85°C; Packaging: Rail/Tube; Package Quantity: 98; Number of Transmitters: 1; Number of Drivers: 1; Number of Transceivers: 1; Supply Current: 2mA; Number of Transmit Buffers: 1; Number of Receive Buffers: 1; Series: SP3485; Length: 4.9mm; Width: 3.9mm; Height: 1.65mm; Radiation Hardening: No; RoHS Compliant: Yes; Lead Free: Lead Free; REACH SVHC: Unknown; ComponentLink1URL: https://datasheet.ciiva.com/23593/1563967-23593299.pdf?src-supplier=Newark; ComponentLink1Description: https://datasheet.ciiva.com/23593/1563967-23593299.pdf?src-supplier=Newark; ComponentLink2URL: https://datasheet.ciiva.com/22828/0900766b81141d5c-22828332.pdf?src-supplier=RSComponents; ComponentLink2Description: https://datasheet.ciiva.com/22828/0900766b81141d5c-22828332.pdf?src-supplier=RSComponents; ComponentLink3URL: https://datasheet.ciiva.com/26829/sp3485en-l-26829691.pdf?src-supplier=IIIC; ComponentLink3Description: https://datasheet.ciiva.com/26829/sp3485en-l-26829691.pdf?src-supplier=IIIC; ComponentLink4URL: https://datasheet.ciiva.com/1495/1563967-1495198.pdf?src-supplier=Element14; ComponentLink4Description: https://datasheet.ciiva.com/1495/1563967-1495198.pdf?src-supplier=Element14; Supplier Part Number 1: 70400827; Link: https://www.digikey.com/es/products/detail/maxlinear-inc/SP3485EN-L/2411077
U14 = ITS4141NHUMA1: IC SWITCH HISIDE SMART SOT223-4; Manufacturer: Infineon; Number of Outputs: 1; Interface: On/Off; Fault Protection: Over Voltage,Over Temperature; Output Configuration: High Side; Max Output Current: 700mA; Supplier 1: Digi-Key; RoHS: Yes; Stock 1: 7213; Case/Package: TO-261-4; Min Operating Temperature: -30°C; Max Operating Temperature: 85°C; Packaging: Tape and Reel; Series: miniPROFET®; ComponentLink1URL: https://www.infineon.com/dgdl/Infineon-ITS4141N-DS-v01_01-en.pdf?folderId=db3a304412b407950112b408e8c90004&amp;fileId=db3a304412b407950112b429624b40d3&amp;ack=t&src-supplier=Digi-Key; ComponentLink1Description: https://www.infineon.com/dgdl/Infineon-ITS4141N-DS-v01_01-en.pdf?folderId=db3a304412b407950112b408e8c90004&amp;fileId=db3a304412b407950112b429624b40d3&amp;ack=t&src-supplier=Digi-Key; Supplier Part Number 1: ITS4141NHUMA1CT-ND; Manufacturer Part Number: ITS4141NHUMA1; Pricing 1: 1=1,84000, 10=1,65100, 25=1,55720, 100=1,32660, 250=1,24568, 500=1,08996, 1000=0,94780 (USD); Link: https://www.digikey.com/es/products/detail/infineon-technologies/ITS4141NHUMA1/2081255?s=N4IgTCBcDaIJIBUDKAWAjOgcgCQKoFkBBNEAXQF8g